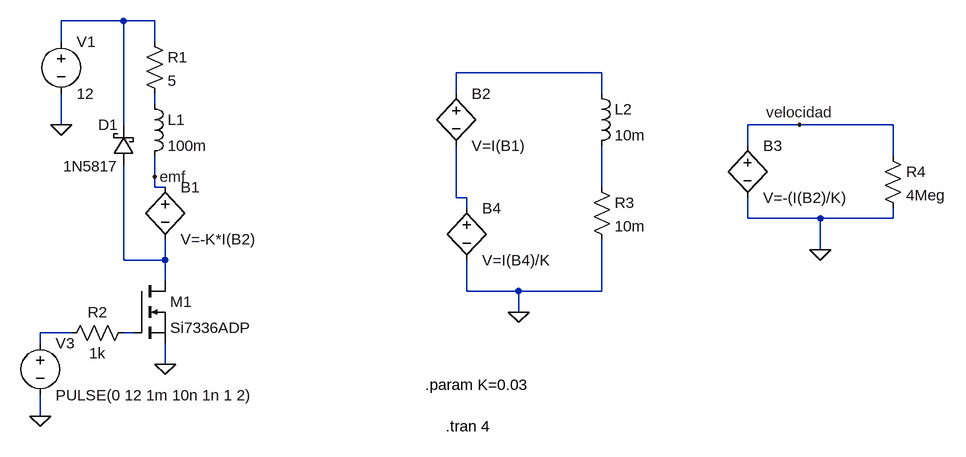
[diagram p0: schematic Motor_DC.asc]
Motor_DC.asc, the LTspice schematic file:
Version 4
SHEET 1 1192 680
WIRE -160 -112 -256 -112
WIRE -112 -112 -160 -112
WIRE -256 -80 -256 -112
WIRE -112 -80 -112 -112
WIRE 576 -32 352 -32
WIRE 352 0 352 -32
WIRE 576 0 576 -32
WIRE -112 16 -112 0
WIRE -256 48 -256 0
WIRE -160 48 -160 -112
WIRE 880 48 800 48
WIRE 1024 48 880 48
WIRE 800 80 800 48
WIRE 1024 96 1024 48
WIRE -112 128 -112 96
WIRE -112 144 -112 128
WIRE -96 144 -112 144
WIRE 576 144 576 80
WIRE 352 160 352 80
WIRE 368 160 352 160
WIRE 368 176 368 160
WIRE 800 192 800 160
WIRE 912 192 800 192
WIRE 1024 192 1024 176
WIRE 1024 192 912 192
WIRE 912 240 912 192
WIRE -160 256 -160 112
WIRE -96 256 -96 224
WIRE -96 256 -160 256
WIRE -96 288 -96 256
WIRE 368 304 368 256
WIRE 448 304 368 304
WIRE 576 304 576 224
WIRE 576 304 448 304
WIRE 448 336 448 304
WIRE -240 368 -288 368
WIRE -144 368 -160 368
WIRE -288 384 -288 368
WIRE -96 416 -96 384
WIRE -288 496 -288 464
FLAG -256 48 0
FLAG -288 496 0
FLAG -96 416 0
FLAG 880 48 velocidad
FLAG -112 128 emf
FLAG 448 336 0
FLAG 912 240 0
SYMBOL Voltage -288 368 R0
SYMATTR InstName V3
SYMATTR Value PULSE(0 12 1m 10n 1n 1 2)
SYMBOL Voltage -256 -96 R0
SYMATTR InstName V1
SYMATTR Value 12
SYMBOL Res -144 352 R90
WINDOW 0 0 56 VBottom 2
WINDOW 3 32 56 VTop 2
SYMATTR InstName R2
SYMATTR Value 1k
SYMBOL Ind -128 0 R0
SYMATTR InstName L1
SYMATTR Value 100m
SYMBOL bv -96 128 R0
SYMATTR InstName B1
SYMATTR Value V=-K*I(B2)
SYMBOL nmos -144 288 R0
SYMATTR InstName M1
SYMATTR Value Si7336ADP
SYMBOL bv 352 -16 R0
SYMATTR InstName B2
SYMATTR Value V=I(B1)
SYMBOL bv 800 64 R0
SYMATTR InstName B3
SYMATTR Value V=-(I(B2)/K)
SYMBOL bv 368 160 R0
SYMATTR InstName B4
SYMATTR Value V=I(B4)/K
SYMBOL Res 560 128 R0
SYMATTR InstName R3
SYMATTR Value 10m
SYMBOL Ind 560 -16 R0
SYMATTR InstName L2
SYMATTR Value 10m
SYMBOL Res 1008 80 R0
SYMATTR InstName R4
SYMATTR Value 4Meg
SYMBOL Res -128 -96 R0
SYMATTR InstName R1
SYMATTR Value 5
SYMBOL schottky -144 112 R180
WINDOW 0 24 64 Left 2
WINDOW 3 24 0 Left 2
SYMATTR InstName D1
SYMATTR Value 1N5817
SYMATTR Description Diode
SYMATTR Type diode
TEXT 304 448 Left 2 !.param K=0.03
TEXT 336 512 Left 2 !.tran 4

The netlist it stands for:
* Motor_DC.asc
V3 N007 0 PULSE(0 12 1m 10n 1n 1 2)
V1 N001 0 12
R2 N008 N007 1k
L1 N003 emf 100m
B1 emf N006 V=-K*I(B2)
M1 N006 N008 0 0 Si7336ADP
B2 N002 N005 V=I(B1)
B3 velocidad 0 V=-(I(B2)/K)
B4 N005 0 V=I(B4)/K
R3 N004 0 10m
L2 N002 N004 10m
R4 velocidad 0 4Meg
R1 N001 N003 5
D1 N006 N001 1N5817
.model D D
.lib standard.dio
.model NMOS NMOS
.model PMOS PMOS
.lib standard.mos
.param K=0.03
.tran 4
.backanno
.end